# Altium schematic sheet CAM-SCH.SchDoc
size A; SheetNumber: 1; SheetTotal: 1
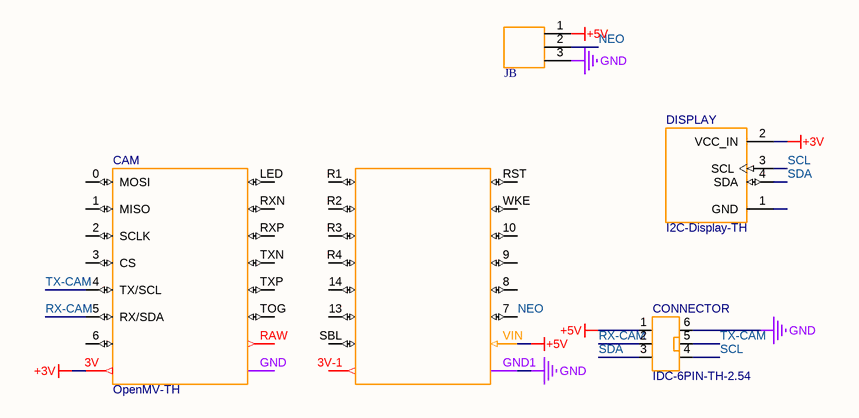
[diagram p0: CAM-SCH.SchDoc]

## Parts
CAM  OpenMV-TH  [OpenMV-TH]
CONNECTOR  IDC-6PIN-TH-2.54  [IDC-6PIN-TH-2.54]
DISPLAY  I2C-Display-TH  [I2C-Display-TH]
JB  3PIN  [3PIN]  (value not drawn)

## Nets
+3V: CAM.3V DISPLAY.2(VCC_IN)
+5V: CAM.VIN CONNECTOR.1 JB.1
GND: CAM.GND1 CONNECTOR.6 JB.3
NEO: CAM.7 JB.2
RX-CAM: CAM.5(RX/SDA) CONNECTOR.2
SCL: CONNECTOR.4 DISPLAY.3(SCL)
SDA: CONNECTOR.3 DISPLAY.4(SDA)
TX-CAM: CAM.4(TX/SCL) CONNECTOR.5

Not connected (* = marked no-connect by the designer): CAM 0(MOSI) 1(MISO) 2(SCLK) 3(CS) 3V-1 6 8 9 10 13 14 GND LED R1 R2 R3 R4 RAW RST RXN RXP SBL TOG TXN TXP WKE; DISPLAY 1(GND)

## Library data of the parts
JB = 3PIN: 2.54 Header